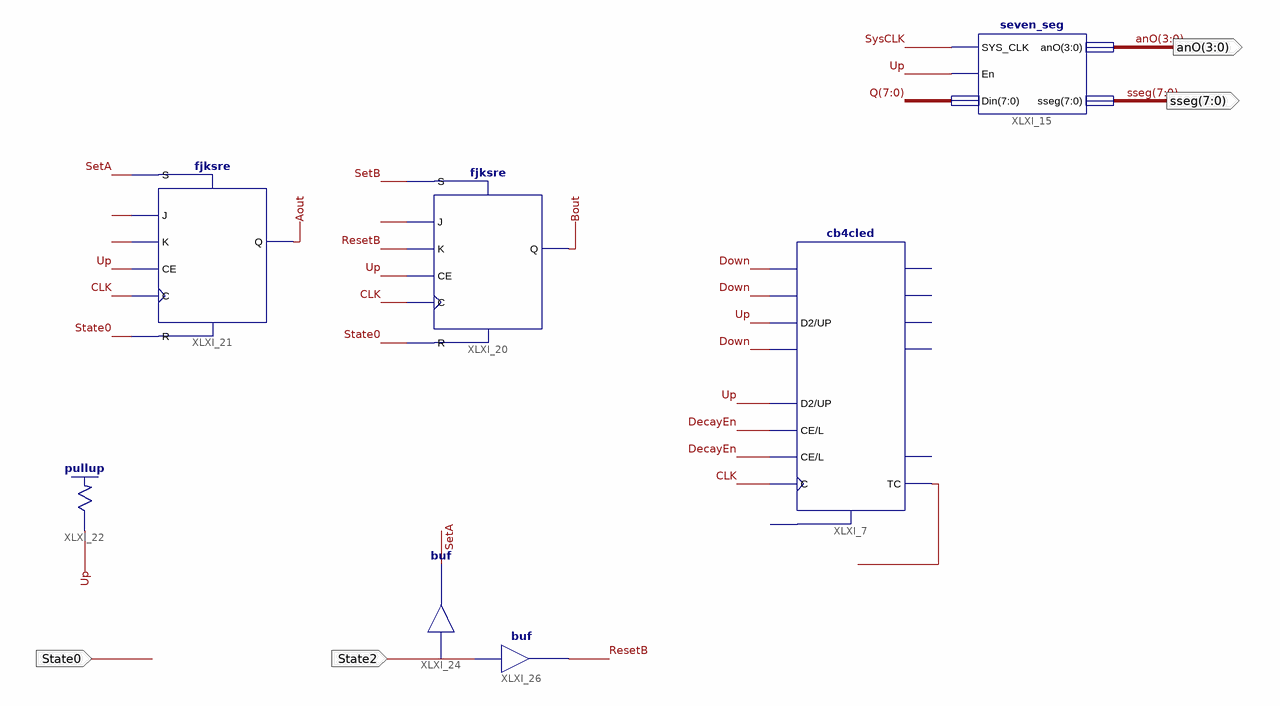
[diagram p0: schematic sheet 1]
// Xilinx ISE schematic Exp1.sch (spartan3e) as structural Verilog: 7 symbols, 4 ports
module Exp1 (
  input  State0,
  input  State2,
  output [7:0] sseg,
  output [3:0] anO
);

  wire Aout, Bout, Bset, CLK, DecayEn, Down, ResetB, SetA, SetB, SysCLK, Up, XLXN_31, XLXN_52, XLXN_53;
  wire [7:0] Q;

  cb4cled XLXI_7 (
    .C(CLK), .CE(DecayEn), .D0(Down), .D1(Down), .D2(Up), .D3(Down), .L(DecayEn), .UP(Up), .TC(XLXN_31));  // open: CLR, CEO, Q0, Q1, Q2, Q3
  seven_seg XLXI_15 (.SYS_CLK(SysCLK), .En(Up), .Din(Q), .anO(anO), .sseg(sseg));
  fjksre XLXI_20 (.C(CLK), .CE(Up), .J(Bset), .K(ResetB), .R(State0), .S(SetB), .Q(Bout));
  fjksre XLXI_21 (.C(CLK), .CE(Up), .J(XLXN_52), .K(XLXN_53), .R(State0), .S(SetA), .Q(Aout));
  \pullup  XLXI_22 (.O(Up));
  buf XLXI_24 (SetA, State2);
  buf XLXI_26 (ResetB, State2);
endmodule
